# Altium schematic sheet GPS.SchDoc
size 420 x 297 mm; SheetNumber: 6; SheetTotal: 7
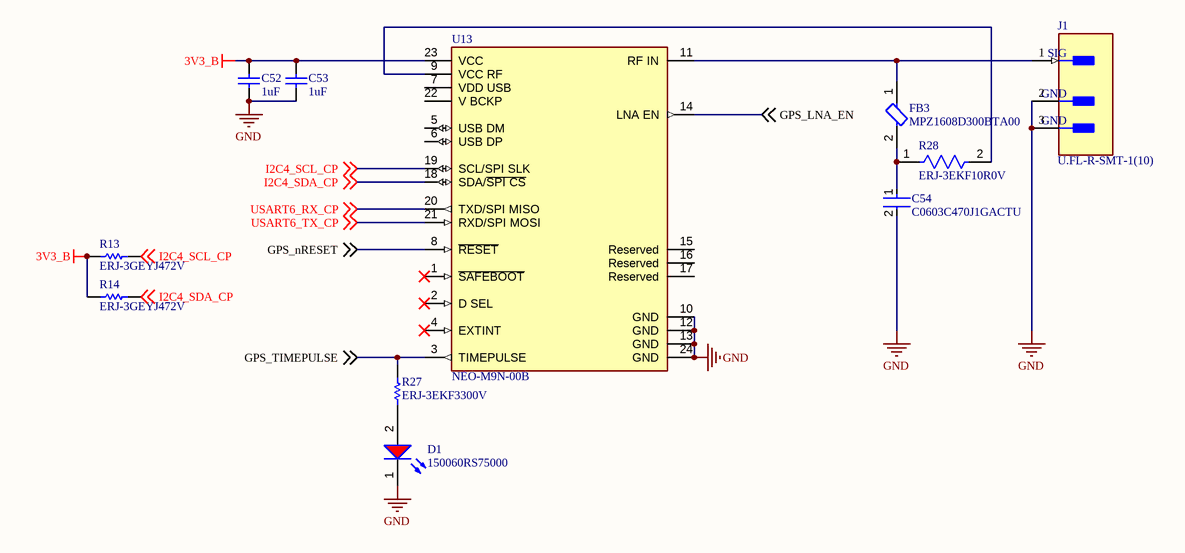
[diagram p0: GPS.SchDoc]

## Parts
C52  1uF  [CAPC1608X90X35LL15T15]
C53  1uF  [CAPC1608X90X35LL15T15]
C54  C0603C470J1GACTU  [FP-C0603C-CF-MFG]
D1  150060RS75000  [WL-SMCW_0603_150060xx75000]
FB3  MPZ1608D300BTA00  [FP-MPZ1608-0_8-IPC_A]
J1  U.FL-R-SMT-1(10)  [FP-U_FL-R-SMT-1_10-MFG]
R13  ERJ-3GEYJ472V  [RESC1608X55X30LL15T15]
R14  ERJ-3GEYJ472V  [RESC1608X55X30LL15T15]
R27  ERJ-3EKF3300V  [RESC1608X55X30LL15T15]
R28  ERJ-3EKF10R0V  [FP-ERJ3EK-MFG]
U13  NEO-M9N-00B  [FP-NEO-M9N-00B-MFG]

## Nets
3V3_B: C52.2 C53.2 R13.1 R14.1 U13.23(VCC)
GND: C52.1 C53.1 C54.2 D1.1(K) J1.2(GND) J1.3(GND) U13.10(GND) U13.12(GND) U13.13(GND) U13.24(GND)
GPS_LNA_EN: U13.14(LNA_EN) ; off-sheet GPS_LNA_EN
GPS_nRESET: U13.8(~{RESET}) ; off-sheet GPS_nRESET
GPS_TIMEPULSE: R27.1 U13.3(TIMEPULSE) ; off-sheet GPS_TIMEPULSE
I2C4_SCL_CP: R13.2 U13.19(SCL/SPI_SLK) ; off-sheet I2C4_SCL_CP
I2C4_SDA_CP: R14.2 U13.18(SDA/~{SPI_CS}) ; off-sheet I2C4_SDA_CP
USART6_RX_CP: U13.20(TXD/SPI_MISO) ; off-sheet USART6_RX_CP
USART6_TX_CP: U13.21(RXD/SPI_MOSI) ; off-sheet USART6_TX_CP
NetC54_1: C54.1 FB3.2 R28.1
NetD1_2: D1.2(A) R27.2
NetFB3_1: FB3.1 J1.1(SIG) U13.11(RF_IN)
NetR28_2: R28.2 U13.9(VCC_RF)

Not connected (* = marked no-connect by the designer): U13 1(~{SAFEBOOT})* 2(D_SEL)* 4(EXTINT)* 5(USB_DM) 6(USB_DP) 7(VDD_USB) 15(Reserved) 16(Reserved) 17(Reserved) 22(V_BCKP)

## Notes on the sheet
- THIS DOCUMENT AND THE DATA DISCLOSED HEREIN OR
- HEREWITH IS THE PROPERTY OF ALTIUM LIMITED AND MAY
- DWG NO:
- REVISION
- REV:
- DESCRIPTION
- DATE
- APPROVED
- BE FREELY DISTRIBUTED IN WHOLE. NO RIGHTS ARE
- RESERVED OR EXPRESS OR IMPLIED WARANTEE GIVEN.
- ENG:
- APPROVALS
- PROJECT
- DSN:
- CHK:
- REFERENCE DOCUMENTS
- PROJECT REVISION:
- TITLE
- DOCUMENT REVISION:
- DESIGN ITEM:
- BOM:
- FAB DWG:
- PCB DWG:
- ASSY DWG:
- SCALE:
- A3
- SIZE
- CAGE CODE
- FILE NAME
- DWG NO.
- SHEET
- OF
- REV

## Library data of the parts
C52 C53 = CMP-2006-02298-2: Manufacturer: Kemet; Part Number: C0603C105K4RACTU
C54 = CMP-2006-03321-2: CAP CER 47PF 100V 5% NP0 0603; Manufacturer: KEMET; Temperature Characteristic: C0G; Temperature Coefficient: 30ppm/°C; Automotive Grade: Grade 1; Material: Ceramic; Tolerance: 0.05; Digikey Description: CAP CER 47PF 100V 5% NP0 0603; Value: 47 pF; Category: Cap; Device Class L2: Capacitors; Device Class L1: Passive Components; Package: C0603C-CF; Octopart: https://octopart.com/c0603c470j1gactu-kemet-3768219; Lead Free: Yes; Temperature Range High: +125°C; Device Class L3: Ceramic Capacitors; Height: 0.87mm; Temperature: -55°C to +125°C; Mouser Description: Multilayer Ceramic Capacitors MLCC - SMD/SMT 100volts 47pF C0G 5%; Automotive: Yes; Capacitance: 47 pF; RoHS: TRUE; ComponentLink2URL: https://api.kemet.com/component-edge/download/datasheet/C0603C100J5GACAUTO.pdf; Voltage Rating: 100 V; Manufacturer Part Number: C0603C470J1GACTU; ComponentLink2Description: Datasheet; Temperature Range Low: -55°C
D1 = CMP-1426-00001-4: LED Low-Power Uni-Color Red 630nm 2V 2-Pin Chip 0603(1608Metric) T/R; Max Junction Temperature (Tj): 95°C; Dominant Wavelength: 625nm; Lens Style: Clear, Rectangular; Viewing Angle: 140°; Forward Current: 100mA; Max Reverse Voltage (DC): 5V; Luminous Intensity: 250mcd; Test Current: 20mA; Power Dissipation: 72mW; Max Operating Temperature: 85°C; Mount: Surface Mount; Height: 700µm; Packaging: Tape and Reel; REACH SVHC: Unknown; Case Code (Metric): 1608; Peak Wavelength: 630nm; Forward Voltage: 2V; Case/Package: 0603; Color: Red; RoHS: Compliant; Width: 800µm; Reverse Voltage: 5V; Min Operating Temperature: -40°C; Wavelength: 625nm; Case Code (Imperial): 0603; Length: 1.6mm
FB3 = CMP-08257-000221-1: FERRITE BEAD 30 OHM 0603 1LN; Max DC Current: 1.8A; Impedance: 30R; DC Resistance (DCR): 60mR; Length: 0.063inch; RoHS Compliant: Yes; Width: 0.031inch; Mount: Surface Mount; Packaging: Tape and Reel; Case Code (Imperial): 0603; Case Code (Metric): 1608; Package Quantity: 4000; Current Rating: 1.8A; Series: MPZ; Core Material: Ferrite; Height: 0.037inch; Case/Package: 0603
J1 = CMP-2000-05152-3: CONN U.FL RCPT STR 50 OHM SMD; Max Frequency: 6GHz; Connector Type: Coaxial; Body Plating: Silver; Body Material: Bronze; Impedance: 50R; Dielectric Material: Polymer; Insulation Resistance: 500MR; Gender: Male; Packaging: Cut Tape; Length: 3mm; Package Quantity: 2500; Termination: Solder; Lead Free: Lead Free; Series: U.FL; Min Operating Temperature: -40°C; Fastening Type: Snap; Contact Material: Brass; Orientation: Straight; Wire/Cable Type: Coaxial; Frequency: 6GHz; Contact Plating: Gold; Depth: 3.1mm; Weight: 0.001764oz; Max Operating Temperature: 90°C; Radiation Hardening: No; REACH SVHC: No SVHC; Mount: Surface Mount; Housing Color: Beige
R13 R14 = CMP-2000-00796-1: Manufacturer: Panasonic; Part Number: ERJ-3GEYJ472V
R27 = CMP-2000-00435-2: Chip Resistor, 330 Ohm, +/- 1%, 0.1 W, -55 to 155 degC, 0603 (1608 Metric), RoHS, Tape and Reel; Gender: Male; Mating Cycles: 10000; Current Rating: 500 mA; Voltage Rating: 10 V; REACH SVHC: No SVHC; PackageDescription: 2-Pin Surface Mount Device, Body 1.6 x 0.85 mm; Contact Finish: Gold; Pins: 8; ComponentLink1Description: Manufacturer URL; Packaging: Tape and Reel; Max Operating Temperature: 85 degC; Contact Material: Copper; Height: 1.45 mm; Width: 1.45 mm; DatasheetVersion: Apr-15; Package Quantity: 1500; Contact Plating: Gold; PackageReference: 0603; Mount: Surface Mount; Lead Pitch: 1.1 mm; Min Operating Temperature: -25 degC; ComponentLink1URL: http://www.panasonic.com/; ComponentLink2URL: http://industrial.panasonic.com/cdbs/www-data/pdf/RDA0000/AOA0000C86.pdf; Length: 13.7 mm; ComponentLink2Description: Datasheet; RoHSCompliant: true
R28 = CMP-2000-00195-2: RES SMD 10 OHM 1% 1/10W 0603; Manufacturer: Panasonic; Resistance: 10Ω; Voltage Rating: 75V; Value: 10Ω; Power: 100mW; Power Rating: 0.1W; Temperature Coefficient: 100ppm/°C; Automotive Grade: Grade 0; Lead Free: Yes; Device Class L1: Passive Components; Digikey Description: RES SMD 10 OHM 1% 1/10W 0603; Octopart: https://octopart.com/erj-3ekf10r0v-panasonic-55403649; Automotive: Yes; ComponentLink2URL: https://b2b-api.panasonic.eu/file_stream/pids/fileversion/1263; Manufacturer Part Number: ERJ-3EKF10R0V; Height: 0.55mm; Temperature Range High: +155°C; Footprint Url: https://industrial.panasonic.com/cdbs/www-data/pdf/RDA0000/DMA0000COL17.pdf; Temperature: -55°C to +155°C; Tolerance: 1%; ComponentLink2Description: Datasheet; Package: ERJ3EK; Device Class L2: Resistors; Category: Res; Ipc Land Pattern Name: RESC16080X45; RoHS: TRUE; Composition: Thick Film; Device Class L3: Chip SMD Resistors; Temperature Range Low: -55°C; Series: ERJ
U13 = CMP-207130-000006-2: M9 standard precision module; Manufacturer: u-blox; Min Supply Voltage: 1.65V; Sensitivity: -167dBm; Interface: I2C,SPI,UART,USB; Max Supply Voltage: 3.6V; Device Class L3: RF Receivers; Category: UNK; Temperature Range Low: -40°C; Temperature Range High: +85°C; ComponentLink2Description: Datasheet; Manufacturer Part Number: NEO-M9N-00B; ComponentLink2URL: https://www.u-blox.com/sites/default/files/NEO-M9N_DataSheet_%28UBX-19014285%29.pdf; Footprint Url: https://www.u-blox.com/sites/default/files/NEO-M9N_Integrationmanual_%28UBX-19014286%29.pdf; Height: 2.6mm; Automotive: No; RoHS: TRUE; Lead Free: Yes; Octopart: https://octopart.com/neo-m9n-00b-u-blox-107315722; Package: 0; Temperature: -40°C to +85°C; Device Class L1: Integrated Circuits (ICs); Device Class L2: RF Semiconductors and Devices